# Altium schematic sheet Uno_2022-03-31.schdoc
size 310 x 211 mm
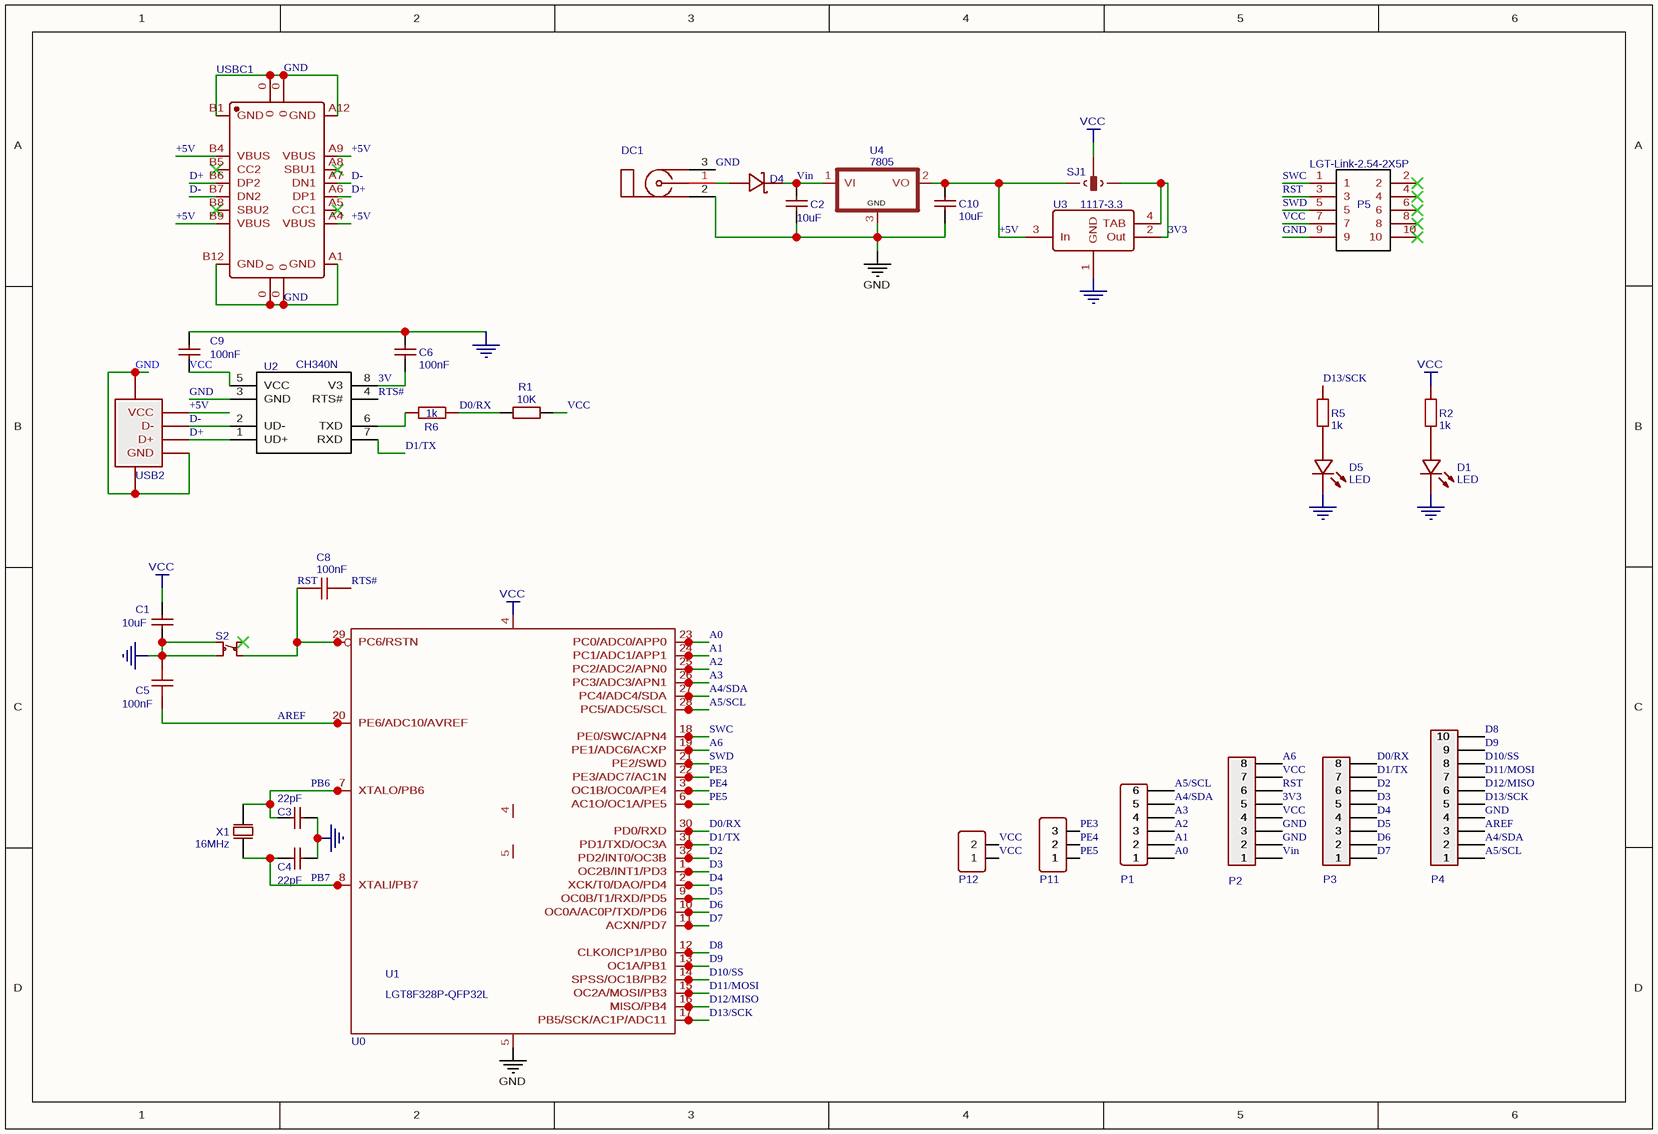
[diagram p0: Uno_2022-03-31.schdoc]

## Parts
C1  10uF  [C0603]
C2  10uF  [C0603]
C3  22pF  [C0603]
C4  22pF  [C0603]
C5  100nF  [C0603]
C6  100nF  [C0603]
C8  100nF  [C0603]
C9  100nF  [C0603]
C10  10uF  [C0603]
D1  LED  [LED-0805]
D4  SS34  [SMA(DO-214AC)]  (value not drawn)
D5  LED  [LED-0805]
DC1  DC005-2.5MM  [DC-IN-TH_DC-5520-AK]  (value not drawn)
P1  Header-Male-2.54_1x6  [1X6_0.8N]  (value not drawn)
P2  Header-Male-2.54_1x8  [1X8_0.8N]  (value not drawn)
P3  Header-Male-2.54_1x8  [1X8_0.8N]  (value not drawn)
P4  Header-Male-2.54_1x10  [1X10_0.8N_100MIL]  (value not drawn)
P5  LGT-Link-2.54-2X5P  [HDR-IDC-2.54-2X5P-AK_HR]
P6  Header-Female-2.54_1x3  [1X3_0.8N_100MIL]  (value not drawn)
P7  Header-Male-2.54_1x8  [1X8_0.8N]  (value not drawn)
P8  Header-Male-2.54_1x10  [1X10_0.8N_100MIL]  (value not drawn)
P9  Header-Male-2.54_1x6  [1X6_0.8N]  (value not drawn)
P10  Header-Male-2.54_1x8  [1X8_0.8N]  (value not drawn)
P11  Header-Female-2.54_1x3  [1X3_0.8N_100MIL]  (value not drawn)
P12  Header-Female-2.54_1x2  [1X2_0.8N]  (value not drawn)
R1  10K  [R0603W]
R2  1k  [R0603W]
R5  1k  [R0603W]
R6  1k  [SOD-323_L1.8-W1.3-LS2.5-A]
S2  TS665CJ-A  [SW-TH_4PIN-L6.00-W6.00]  (value not drawn)
SJ1  JUMPER-PAD-3-2OF3_NC_BY_PASTE  [JUMPER_SOLDER]  (value not drawn)
U0  LGT8F328P_Socket_LQFP32  [QFP32-0.8-TP01NT]  (value not drawn)
U1  LGT8F328P-QFP32L  [TQFP32-08-CHECKOK]
U2  CH340N  [SOP8_150MIL_JX]
U3  1117-3.3  [SOT-223_L6.5-W3.5-P2.30-LS7.0-BR]
U4  7805  [TO252]
USB2  USB B 90  [USB-M-49-AK]  (value not drawn)
USBC1  TYPE-C-31-M-12  [USB-TYPE-C_16PIN-MALE-TYPE-C-31-M-12-AK]  (value not drawn)
X1  16MHz  [OSC-49S-A]

## Nets
GND: C1.1 C2.1 C3.2 C4.2 C5.2 C6.2 C9.2 C10.1 D1.2(K) D5.2(K) DC1.2 DC1.3 P2.2 P2.3 P4.4 P5.9 P8.4 P10.2 P10.3 S2.1(A) S2.2(B) U0.5(GND) U2.3(GND) U3.1(GND) U4.3(GND) USB2.4(GND) USB2.5 USB2.6 USBC1.0 USBC1.A1(GND) USBC1.A12(GND) USBC1.B1(GND) USBC1.B12(GND)
VCC: C1.2 C9.1 P2.4 P2.7 P5.7 P10.4 P10.7 P12.1 P12.2 R1.2 R2.2 SJ1.2 U0.4(VCC) U2.5(VCC)
3V: C6.1 U2.8(V3)
3V3: P2.5 P10.5 SJ1.1 U3.2(Out) U3.4(TAB)
+5V: C10.2 SJ1.3 U3.3(In) U4.2(VO) USB2.1(VCC) USBC1.A4(VBUS) USBC1.A9(VBUS) USBC1.B4(VBUS) USBC1.B9(VBUS)
A0: P1.1 P9.1 U0.23(PC0/ADC0/APP0) U1.23(PC0/ADC0/APP0)
A1: P1.2 P9.2 U0.24(PC1/ADC1/APP1) U1.24(PC1/ADC1/APP1)
A2: P1.3 P9.3 U0.25(PC2/ADC2/APN0) U1.25(PC2/ADC2/APN0)
A3: P1.4 P9.4 U0.26(PC3/ADC3/APN1) U1.26(PC3/ADC3/APN1)
A4/SDA: P1.5 P4.2 P8.2 P9.5 U0.27(PC4/ADC4/SDA) U1.27(PC4/ADC4/SDA)
A5/SCL: P1.6 P4.1 P8.1 P9.6 U0.28(PC5/ADC5/SCL) U1.28(PC5/ADC5/SCL)
A6: P2.8 P10.8 U0.19(PE1/ADC6/ACXP) U1.19(PE1/ADC6/ACXP)
AREF: C5.1 P4.3 P8.3 U0.20(PE6/ADC10/AVREF) U1.20(PE6/ADC10/AVREF)
D0/RX: P3.8 P7.8 R1.1 R6.2 U0.30(PD0/RXD) U1.30(PD0/RXD)
D1/TX: P3.7 P7.7 U0.31(PD1/TXD/OC3A) U1.31(PD1/TXD/OC3A) U2.7(RXD)
D2: P3.6 P7.6 U0.32(PD2/INT0/OC3B) U1.32(PD2/INT0/OC3B)
D3: P3.5 P7.5 U0.1(OC2B/INT1/PD3) U1.1(OC2B/INT1/PD3)
D4: P3.4 P7.4 U0.2(XCK/T0/DAO/PD4) U1.2(XCK/T0/DAO/PD4)
D5: P3.3 P7.3 U0.9(OC0B/T1/RXD/PD5) U1.9(OC0B/T1/RXD/PD5)
D6: P3.2 P7.2 U0.10(OC0A/AC0P/TXD/PD6) U1.10(OC0A/AC0P/TXD/PD6)
D7: P3.1 P7.1 U0.11(ACXN/PD7) U1.11(ACXN/PD7)
D8: P4.10 P8.10 U0.12(CLKO/ICP1/PB0) U1.12(CLKO/ICP1/PB0)
D9: P4.9 P8.9 U0.13(OC1A/PB1) U1.13(OC1A/PB1)
D10/SS: P4.8 P8.8 U0.14(SPSS/OC1B/PB2) U1.14(SPSS/OC1B/PB2)
D11/MOSI: P4.7 P8.7 U0.15(OC2A/MOSI/PB3) U1.15(OC2A/MOSI/PB3)
D12/MISO: P4.6 P8.6 U0.16(MISO/PB4) U1.16(MISO/PB4)
D13/SCK: P4.5 P8.5 R5.2 U0.17(PB5/SCK/AC1P/ADC11) U1.17(PB5/SCK/AC1P/ADC11)
D+: U2.1(UD+) USB2.3(D+) USBC1.A6(DP1) USBC1.B6(DP2)
D-: U2.2(UD-) USB2.2(D-) USBC1.A7(DN1) USBC1.B7(DN2)
PB6: C3.1 U0.7(XTALO/PB6) U1.7(XTALO/PB6) X1.2(OSC2)
PB7: C4.1 U0.8(XTALI/PB7) U1.8(XTALI/PB7) X1.1(OSC1)
PE3: P6.3 P11.3 U0.22(PE3/ADC7/AC1N) U1.22(PE3/ADC7/AC1N)
PE4: P6.2 P11.2 U0.3(OC1B/OC0A/PE4) U1.3(OC1B/OC0A/PE4)
PE5: P6.1 P11.1 U0.6(AC1O/OC1A/PE5) U1.6(AC1O/OC1A/PE5)
RST: C8.2 P2.6 P5.3 P10.6 S2.4(D) U0.29(PC6/RSTN) U1.29(PC6/RSTN)
RTS#: C8.1 U2.4(RTS#)
SWC: P5.1 U0.18(PE0/SWC/APN4) U1.18(PE0/SWC/APN4)
SWD: P5.5 U0.21(PE2/SWD) U1.21(PE2/SWD)
Vin: C2.2 D4.2(K) P2.1 P10.1 U4.1(VI)
NetD1_1: D1.1(A) R2.1
NetD4_1: D4.1(A) DC1.1(VCC)
NetD5_1: D5.1(A) R5.1
NetR6_1: R6.1 U2.6(TXD)

Not connected (* = marked no-connect by the designer): P5 2* 4* 6* 8* 10*; S2 3(C)*; U1 4(VCC) 5(GND); USBC1 A5(CC1)* A8(SBU1)* B5(CC2)* B8(SBU2)*

## Library data of the parts
C1 C2 C10 = 10uF: BOM_Manufacturer Part: CL21A106KAYNNNE; BOM_Manufacturer: SAMSUNG; Voltage: 25V; Tolerance: ±10%; nameAlias: Value; BOM_Supplier: LCSC; BOM_LCSC Assembly: Yes; image: http://image.lceda.cn/szlcsc/C15850.jpg; spicePre: C; spiceSymbolName: CL21A106KAYNNNE; BOM_Supplier Part: C15850
C3 C4 = 22pF: BOM_Manufacturer Part: CL10C220JB8NNNC; BOM_Manufacturer: SAMSUNG; Voltage: 50V; Tolerance: ±5%; nameAlias: Value; BOM_Supplier: LCSC; BOM_LCSC Assembly: Yes; image: http://image.lceda.cn/szlcsc/C1653.jpg; spicePre: C; spiceSymbolName: CL10C220JB8NNNC; BOM_Supplier Part: C1653
C5 C8 = 100nF: BOM_Manufacturer: YAGEO; BOM_Manufacturer Part: CC0603KRX7R9BB104; Voltage: 50V; Tolerance: ±10%; nameAlias: Value; BOM_Supplier: LCSC; BOM_LCSC Assembly: Yes; image: http://image.lceda.cn/szlcsc/C14663.jpg; spicePre: C; spiceSymbolName: CC0603KRX7R9BB104; BOM_Supplier Part: C14663
C6 C9 = 100nF: BOM_Manufacturer Part: CL21A106KAYNNNE; BOM_Manufacturer: SAMSUNG; Voltage: 25V; Tolerance: ±10%; nameAlias: Value; BOM_Supplier: LCSC; BOM_LCSC Assembly: Yes; image: http://image.lceda.cn/szlcsc/C15850.jpg; spicePre: C; spiceSymbolName: CL21A106KAYNNNE; BOM_Supplier Part: C15850
D1 D5 = LED: nameAlias: Model; BOM_Manufacturer Part: ?; spicePre: D; spiceSymbolName: LED
D4 = SS34: BOM_Manufacturer: MDD; BOM_Supplier: LCSC; BOM_Manufacturer Part: SS34; image: //image.lceda.cn/szlcsc/C8678.jpg; spicePre: D; BOM_Supplier Part: C8678
DC1 = DC005-2.5MM: BOM_Manufacturer: SOFNG; BOM_Supplier: LCSC; BOM_Manufacturer Part: DC005-2.5MM; spicePre: D; BOM_Supplier Part: C111573
P1 P9 = Header-Male-2.54_1x6: BOM_Manufacturer: BOOMELE; BOM_Supplier: LCSC; BOM_Manufacturer Part: Header-Male-2.54_1x6; spicePre: P; BOM_Supplier Part: C37208
P2 P3 P7 P10 = Header-Male-2.54_1x8: BOM_Manufacturer: EasyEDA; BOM_Supplier: EasyEDA; BOM_Manufacturer Part: Header-Male-2.54_1x8; spicePre: P; BOM_Supplier Part: E49256
P4 P8 = Header-Male-2.54_1x10: BOM_Manufacturer: BOOMELE; BOM_Manufacturer Part: Header-Female-1.27_1x10; BOM_Supplier: LCSC; image: //image.lceda.cn/szlcsc/C29357.jpg; spicePre: P; BOM_Supplier Part: C29357
P5 = LGT-Link-2.54-2X5P: BOM_Manufacturer: ReliaPro; BOM_Manufacturer Part: IDC Box 2.54mm 2X5P; BOM_Supplier: LCSC; spicePre: P; BOM_Supplier Part: C5665
P6 P11 = Header-Female-2.54_1x3: BOM_Manufacturer: Boom Precision Elec; BOM_Supplier Part: C146243; BOM_Supplier: LCSC; BOM_Manufacturer Part: Header-Female-2.54_1x3; link: https://datasheet.lcsc.com/szlcsc/Boom-Precision-Elec-2-54mm-1-8P-Straight-Female-header_C27438.pdf; spicePre: P
P12 = Header-Female-2.54_1x2: BOM_Manufacturer: BOOMELE; BOM_Manufacturer Part: 2.54-1*2PFemale; BOM_Supplier: LCSC; image: //image.lceda.cn/szlcsc/C49661.jpg; BOM_Supplier Part: C49661; spicePre: P
R1 = 10K: BOM_Manufacturer: FH; BOM_Manufacturer Part: RS-03K103JT; nameAlias: Resistance (Ohms); BOM_Supplier: LCSC; BOM_Supplier Part: C73809; spicePre: R; spiceSymbolName: RS-03K103JT
R2 R5 R6 = 1k: nameAlias: Value(Ω); BOM_Manufacturer Part: ?; spicePre: R; spiceSymbolName: Resistor
S2 = TS665CJ-A: BOM_Manufacturer: SHOU HAN; Contributor: 回收站; BOM_Supplier: LCSC; BOM_Supplier Part: C393938; BOM_Manufacturer Part: TS665CJ; spicePre: S; spiceSymbolName: TS665CJ-A
SJ1 = JUMPER-PAD-3-2OF3_NC_BY_PASTE: Contributor: SparkFun; BOM_Manufacturer Part: ?; spicePre: S
U0 = LGT8F328P_Socket_LQFP32: BOM_Manufacturer: HMiLU; BOM_Manufacturer Part: IC51-0324-1498; Contributor: sino; BOM_Supplier: TB; BOM_Supplier Part: IC51-0324-1498; link: https://item.taobao.com/item.htm?id=527395265591; spicePre: U
U1 = LGT8F328P-QFP32L: Contributor: costar; BOM_Manufacturer Part: ?; spicePre: U
U2 = CH340N: BOM_Manufacturer: WCH; BOM_Manufacturer Part: CH330N; BOM_Supplier: LCSC; spicePre: U; BOM_Supplier Part: C108996
U3 = 1117-3.3: BOM_Manufacturer: AMS; BOM_Manufacturer Part: AMS1117-3.3; sourceId: dwIGgezVh; SMT Type: Basic; timeStamp: 1476261164; BOM_Supplier: LCSC; BOM_LCSC Assembly: Yes; image: //image.lceda.cn/szlcsc/C6186.jpg; BOM_Supplier Part: C6186; spicePre: U
U4 = 7805: description: Positive VOLTAGE REGULATOR; Contributor: Adafruit; BOM_Manufacturer Part: ?; spicePre: U
USB2 = USB B 90: BOM_Manufacturer: ValuePro; BOM_Manufacturer Part: USB BFemale90Degree of iron feet White plastic; BOM_Supplier: LCSC; spicePre: U; BOM_Supplier Part: C46392
USBC1 = TYPE-C-31-M-12: BOM_Manufacturer: Rectangular Connectors - Contacts; Contributor: LCSC; BOM_Supplier: LCSC; BOM_Supplier Part: C165948; BOM_Manufacturer Part: TYPE-C-31-M-12; spicePre: U
X1 = 16MHz: BOM_Manufacturer: Yangxing Tech; BOM_Manufacturer Part: X49SD16MSB2SI; nameAlias: Frequency; Contributor: LCSC; BOM_Supplier: LCSC; BOM_Supplier Part: C188202; spicePre: X; spiceSymbolName: X49SD16MSB2SI